# EAGLE design RevA (EAGLE 7.3.0)
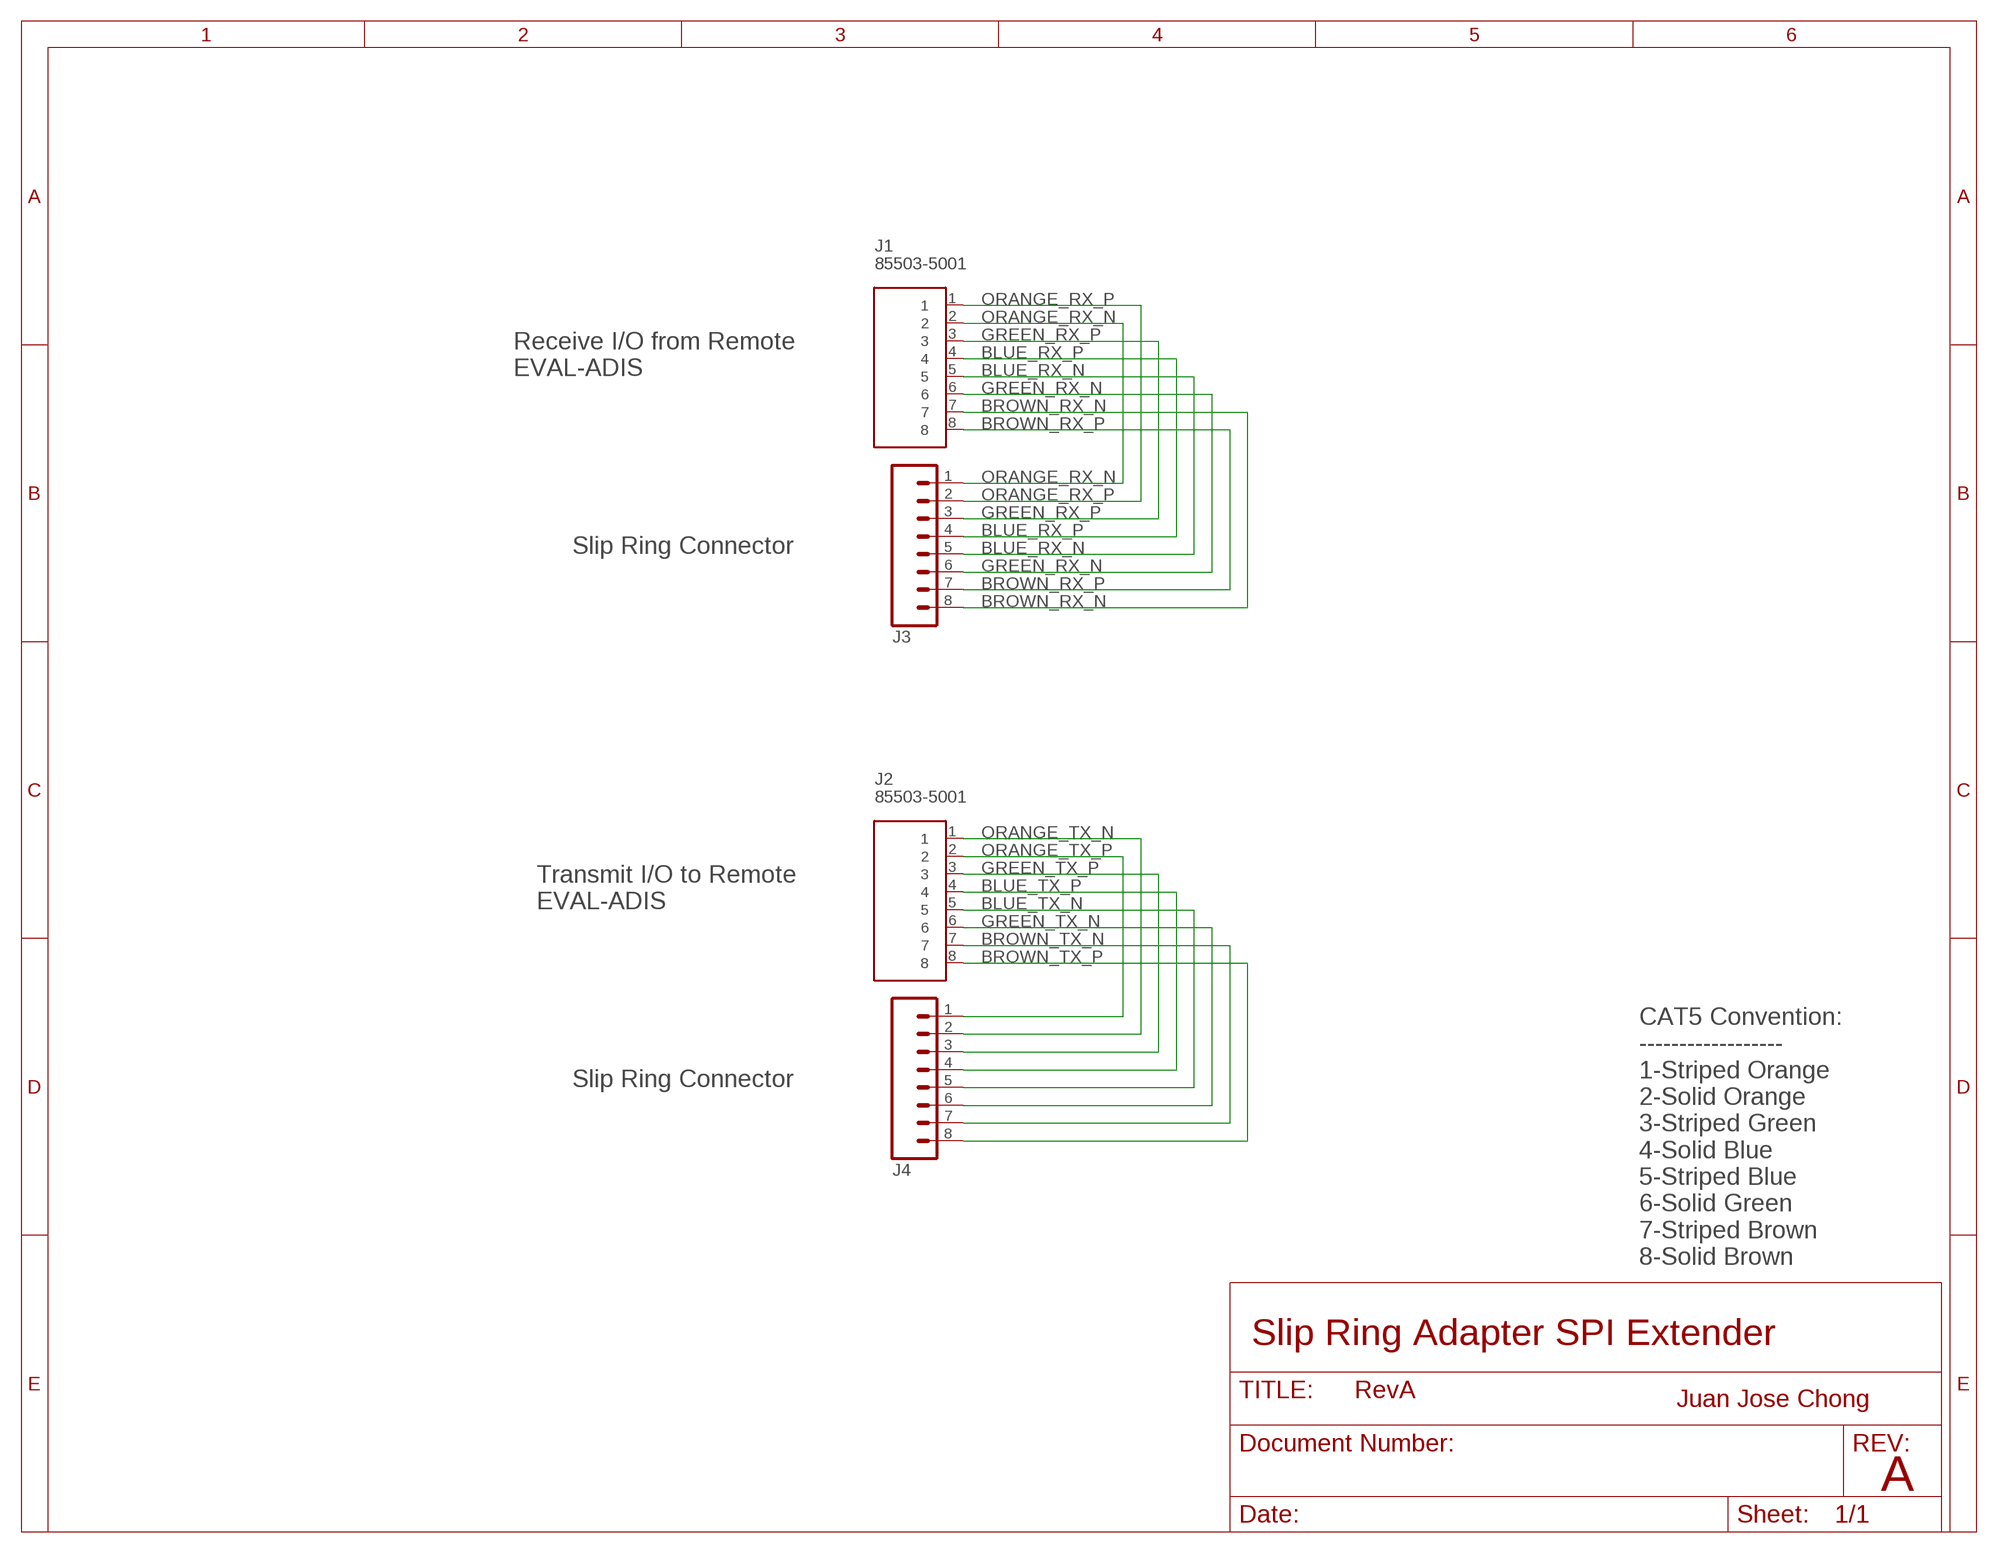
[diagram p0: schematic, sheet 1]

## Parts
J1  85503-5001  [85503-5001]
J2  85503-5001  [85503-5001]
J3  M08LOCK  [1X08_LOCK]
J4  M08LOCK  [1X08_LOCK]

## Nets
BLUE_RX_N: J1.5 J3.5
BLUE_RX_P: J1.4 J3.4
BLUE_TX_N: J2.5 J4.5
BLUE_TX_P: J2.4 J4.4
BROWN_RX_N: J1.7 J3.8
BROWN_RX_P: J1.8 J3.7
BROWN_TX_N: J2.7 J4.7
BROWN_TX_P: J2.8 J4.8
GREEN_RX_N: J1.6 J3.6
GREEN_RX_P: J1.3 J3.3
GREEN_TX_N: J2.6 J4.6
GREEN_TX_P: J2.3 J4.3
ORANGE_RX_N: J1.2 J3.1
ORANGE_RX_P: J1.1 J3.2
ORANGE_TX_N: J2.1 J4.2
ORANGE_TX_P: J2.2 J4.1

## Notes on the sheet
- Receive I/O from Remote
  EVAL-ADIS
- Slip Ring Connector
- Transmit I/O to Remote
  EVAL-ADIS
- Slip Ring Connector
- CAT5 Convention:
  ------------------
  1-Striped Orange
  2-Solid Orange
  3-Striped Green
  4-Solid Blue
  5-Striped Blue
  6-Solid Green
  7-Striped Brown
  8-Solid Brown
- Slip Ring Adapter SPI Extender
- Juan Jose Chong
- A

## Library data of the parts
J1 J2 = AnalogDevices:85503-5001; PARTNO: 855035001
J3 J4 = SparkFun-Connectors:M08: Header 8 Standard 8-pin 0.1" header. Use with straight break away headers (SKU : PRT-00116), right angle break away headers (PRT-00553), swiss pins (PRT-00743), machine pins (PRT-00117), and female headers (PRT-00115).

## Board
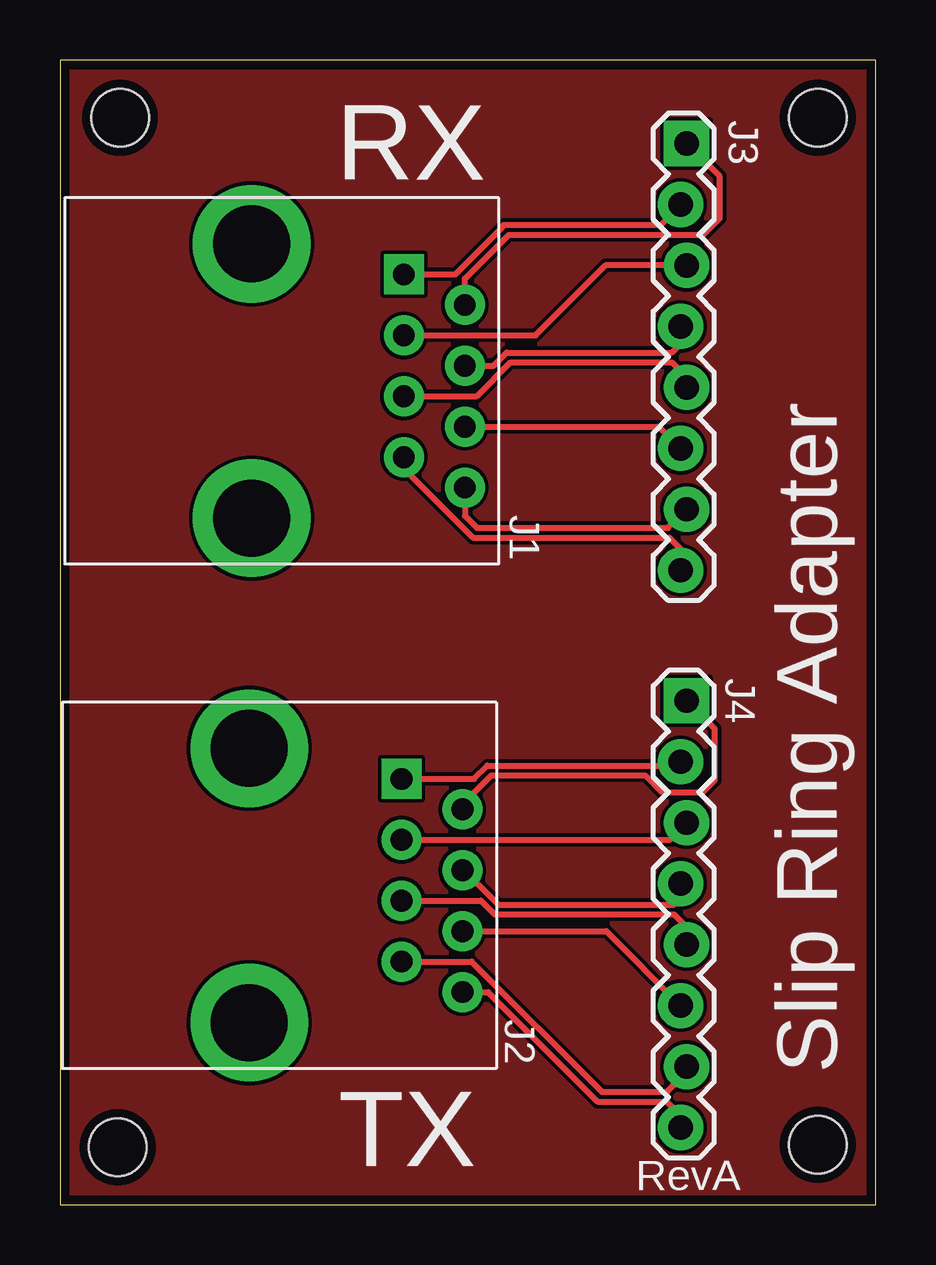
[diagram p1: board, top side]
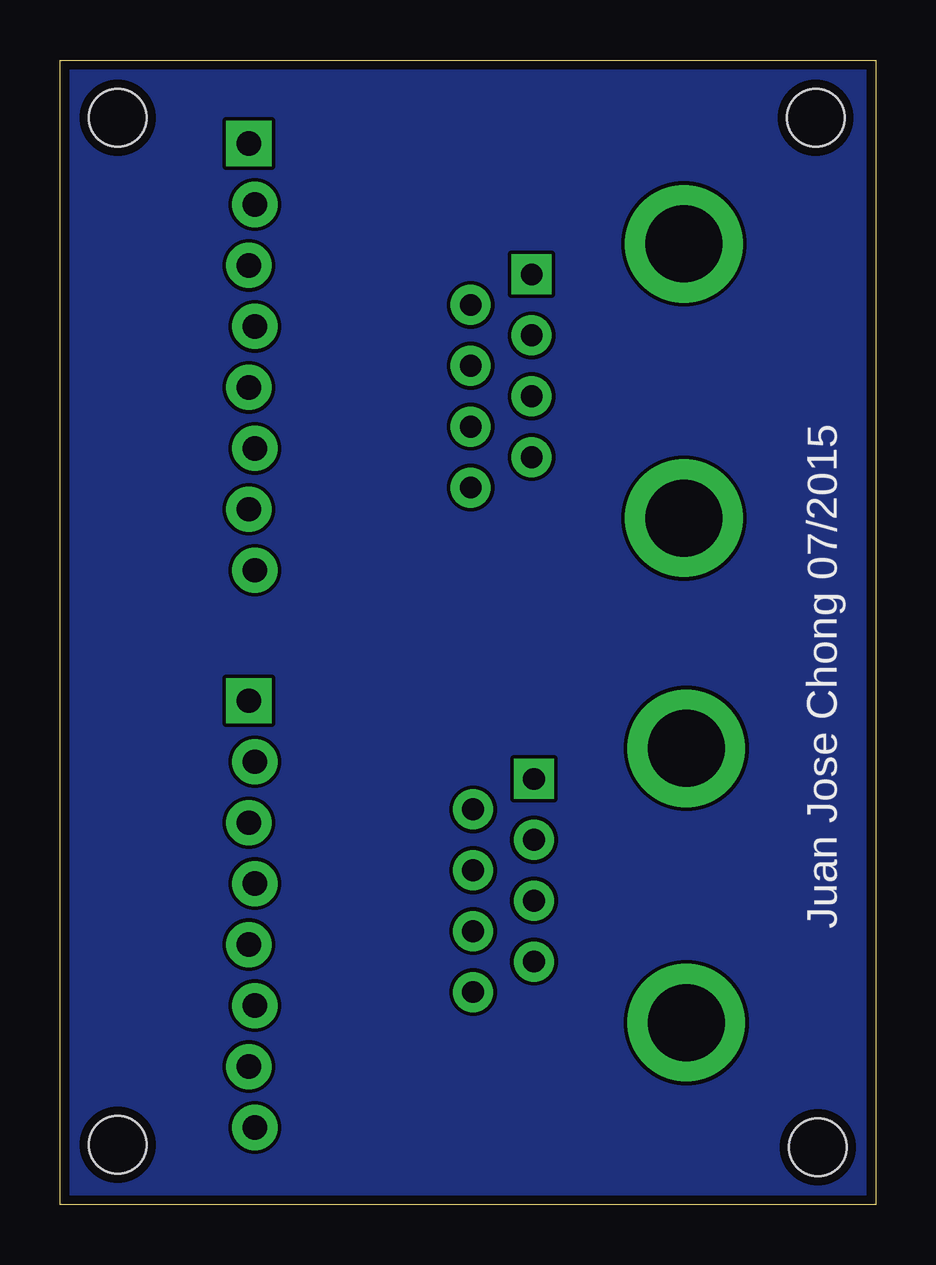
[diagram p2: board, bottom side, seen from below]

Size 34 x 47.7 mm. Coordinates in mm from the lower left corner, seen from the top.
Outline: 0,0 34,0 34,47.7 0,47.7 0,0
Copper layers (1*16): Top 0.0356mm / dielectric 1.5011mm / Bottom 0.0356mm
Design rules "LaenPCBOrder": minimum track width 6mil, minimum drill 13mil, track to track 6mil, track to pad 6mil, pad to pad 6mil, via to via 6mil, smd to smd 6mil, copper to edge 15mil, drill to drill 6mil, minimum pad ring 7mil, minimum via ring 7mil, stop-mask expansion 4mil, vias tented up to drill 0mil, thermal gap 10mil
Holes 2.4 mm at 2.5,45.3 2.4,2.4 31.6,2.5 31.6,45.3
tRestrict: 1 lines

### Footprints (pad centres in the part's own frame; a part is rotated, then mirrored left to right if it is on the bottom)
85503-5001 = drill 0.9 pad 1.676 square: 1 0,0 | drill 0.9 pad 1.676: 2 1.27,2.54; 3 2.54,0; 4 3.81,2.54; 5 5.08,0; 6 6.35,2.54; 7 7.62,0; 8 8.89,2.54 | drill 3.2 pad 4.9: P$1 -1.27,-6.35; P$2 10.16,-6.35
1X08_LOCK = drill 1.016 pad 1.88 square: 1 0,0.127 | drill 1.016 pad 1.88: 2 2.54,-0.127; 3 5.08,0.127; 4 7.62,-0.127; 5 10.16,0.127; 6 12.7,-0.127; 7 15.24,0.127; 8 17.78,-0.127

### Placement (x,y rotation side)
J1  14.34,38.77 270 top
J2  14.24,17.75 270 top
J3  26,44.22 270 top
J4  26,21 270 top

### Tracks (layer width: path | path; a pad name or v marks a point on that pad's centre or on a via)
BLUE_RX_N
  Top 0.254: J1.5 17.38,33.69 18.78,35.1 25.5,35.1 26,34.6 26,34.19 J3.5
BLUE_RX_P
  Top 0.254: J1.4 18.07,34.96 18.62,35.5 25.5,35.5 25.9,35.9 25.9,36.57 J3.4
BLUE_TX_N
  Top 0.254: J2.5 17.54,12.67 18.12,12.1 25.6,12.1 26.1,11.6 26.1,10.87 J4.5
BLUE_TX_P
  Top 0.254: J2.4 16.85,13.94 18.28,12.5 25.6,12.5 25.9,12.8 25.9,13.35 J4.4
BROWN_RX_N
  Top 0.254: J1.7 14.34,30.67 17.22,27.8 25.4,27.8 26,27.2 26,26.57 J3.8
BROWN_RX_P
  Top 0.254: J1.8 16.88,28.71 17.38,28.2 25.35,28.2 J3.7
BROWN_TX_N
  Top 0.254: J2.7 17.16,10.13 22.58,4.7 25.3,4.7 25.6,5 25.6,5.23 J4.7
BROWN_TX_P
  Top 0.254: J2.8 17.85,8.86 22.42,4.3 25.3,4.3 25.6,4 25.6,3.49 J4.8
GND
  pour Top (rank 6, no thermals): 0,0 34,0 34,47.7 0,47.7
  pour Bottom (rank 6, no thermals): 0,0 34,0 34,47.7 0,47.7
GREEN_RX_N
  Top 0.254: J1.6 24.97,32.42 J3.6
GREEN_RX_P
  Top 0.254: J1.3 19.83,36.23 22.74,39.14 J3.3
GREEN_TX_N
  Top 0.254: J2.6 22.77,11.4 J4.6
GREEN_TX_P
  Top 0.254: J2.3 25.42,15.21 J4.3
ORANGE_RX_N
  Top 0.254: J1.2 16.88,38.59 18.71,40.42 26.82,40.42 27.5,41.1 27.5,42.85 J3.1
ORANGE_RX_P
  Top 0.254: J1.1 16.48,38.77 18.36,40.64 18.36,40.66 18.5,40.83 25.05,40.83 J3.2
ORANGE_TX_N
  Top 0.254: J2.1 17.26,17.75 17.82,18.3 25.72,18.3 J4.2
ORANGE_TX_P
  Top 0.254: J2.2 16.78,16.69 17.98,17.9 24.4,17.9 25.1,17.2 26.8,17.2 27.3,17.7 27.3,19.83 J4.1

### Text on the board
tNames: RX | Slip Ring Adapter | TX | RevA
bNames: Juan Jose Chong 07/2015